# EAGLE design StartStopSwitch (EAGLE 9.6.2)
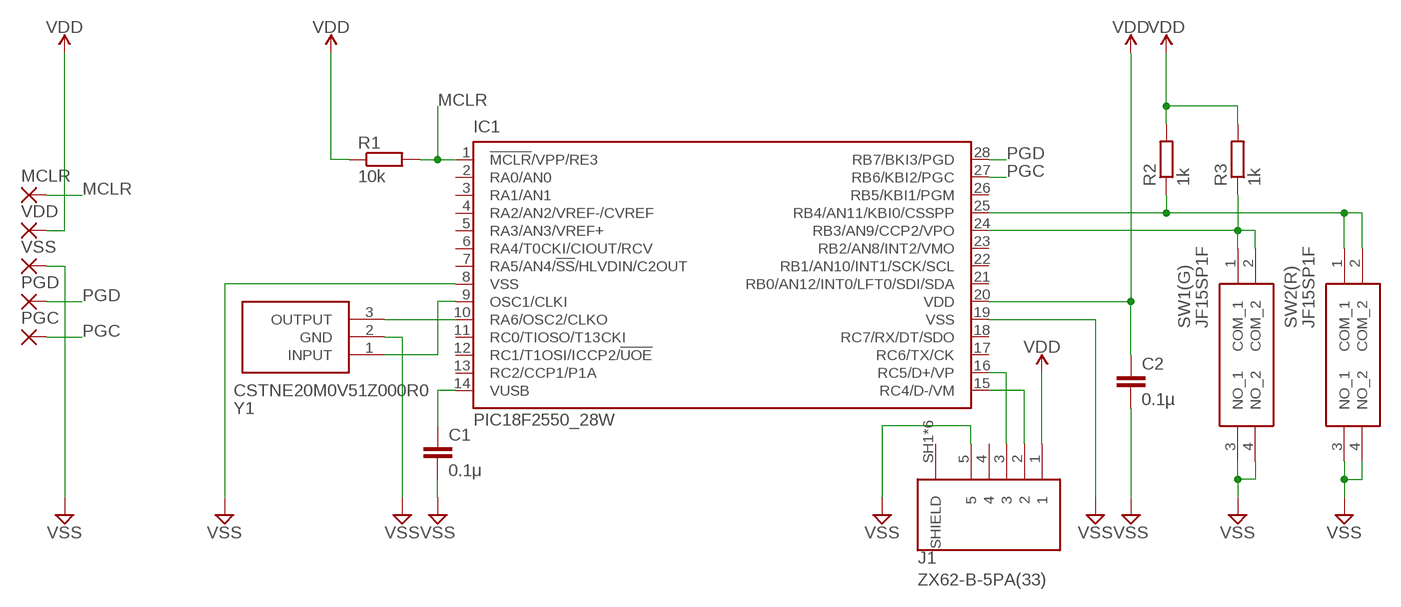
[diagram p0: schematic, sheet 1]

## Parts
C1  0.1μ  C-EUC0603  [C0603]
C2  0.1µ  C-EUC0603  [C0603]
IC1  PIC18F2550_28W  [SO28W]
J1  ZX62-B-5PA(33)  [HRS_ZX62-B-5PA(33)]
MCLR  1,6/0,8  [1,6/0,8]
PGC  1,6/0,8  [1,6/0,8]
PGD  1,6/0,8  [1,6/0,8]
R1  10k  R-EU_R0603  [R0603]
R2  1k  R-EU_R0603  [R0603]
R3  1k  R-EU_R0603  [R0603]
SW1(G)  JF15SP1F  [JF15SP1F]
SW2(R)  JF15SP1F  [JF15SP1F]
VDD  1,6/0,8  [1,6/0,8]
VSS  1,6/0,8  [1,6/0,8]
Y1  CSTNE20M0V51Z000R0  [CSTNE20M0V51Z000R0]

## Nets
MCLR: IC1.1(!MCLR!/VPP/RE3) MCLR.1(P) R1.2
N$1: C1.1 IC1.14(VUSB)
N$2: IC1.10(RA6/OSC2/CLKO) Y1.3(OUTPUT)
N$3: IC1.9(OSC1/CLKI) Y1.1(INPUT)
N$4: IC1.24(RB3/AN9/CCP2/VPO) R3.1 SW1(G).1(COM_1) SW1(G).2(COM_2)
N$5: IC1.25(RB4/AN11/KBI0/CSSPP) R2.1 SW2(R).1(COM_1) SW2(R).2(COM_2)
N$6: IC1.15(RC4/D-/VM) J1.2
N$7: IC1.16(RC5/D+/VP) J1.3
PGC: IC1.27(RB6/KBI2/PGC) PGC.1(P)
PGD: IC1.28(RB7/BKI3/PGD) PGD.1(P)
VDD [New Class]: C2.1 IC1.20(VDD) J1.1 R1.1 R2.2 R3.2 VDD.1(P)
VSS [New Class]: C1.2 C2.2 IC1.8(VSS) IC1.19(VSS) J1.5 SW1(G).3(NO_1) SW1(G).4(NO_2) SW2(R).3(NO_1) SW2(R).4(NO_2) VSS.1(P) Y1.2(GND)
Unconnected: IC1.2(RA0/AN0) IC1.3(RA1/AN1) IC1.4(RA2/AN2/VREF-/CVREF) IC1.5(RA3/AN3/VREF+) IC1.6(RA4/T0CKI/CIOUT/RCV) IC1.7(RA5/AN4/!SS!/HLVDIN/C2OUT) IC1.11(RC0/TIOSO/T13CKI) IC1.12(RC1/T1OSI/ICCP2/!UOE) IC1.13(RC2/CCP1/P1A) IC1.17(RC6/TX/CK) IC1.18(RC7/RX/DT/SDO) IC1.21(RB0/AN12/INT0/LFT0/SDI/SDA) IC1.22(RB1/AN10/INT1/SCK/SCL) IC1.23(RB2/AN8/INT2/VMO) IC1.26(RB5/KBI1/PGM) J1.4 J1.SH1(SHIELD) J1.SH2(SHIELD) J1.SH3(SHIELD) J1.SH4(SHIELD) J1.SH5(SHIELD) J1.SH6(SHIELD)

## Library data of the parts
C1 C2 = rcl:C-EU: CAPACITOR, European symbol; SPICEPREFIX: C
IC1 = microchip:PIC18F2*_28: USB Microcontrollers with nanoWatt Technology High-Performance, Enhanced Flash, 28/40/44-Pin, Source: http://ww1.microchip.com/downloads/en/devicedoc/39632c.pdf; MF: MICROCHIP; MPN: PIC18F2550-I/SO; OC_FARNELL: 9321268; OC_NEWARK: 73K1297
J1 = ZX62-B-5PA_33_:ZX62-B-5PA(33): ZX Series 5 Position Right Angle PCB Wire Micro B USB Plug Check prices <https://pricing.snapeda.com/parts/ZX62-B-5PA%2833%29/Hirose/view-part?ref=eda>; AVAILABILITY: In Stock; DESCRIPTION: USB - micro B USB 2.0 Receptacle Connector 5 Position Surface Mount, Right Angle; MF: Hirose; MP: ZX62-B-5PA(33); PACKAGE: None; PRICE: None; PURCHASE-URL: https://pricing.snapeda.com/search/part/ZX62-B-5PA(33)/?ref=eda
MCLR PGC PGD VDD VSS = wirepad:1,6/0,8: THROUGH-HOLE PAD
R1-R3 = rcl:R-EU_: RESISTOR, European symbol; SPICEPREFIX: R
SW1(G) SW2(R) = JF15SP1F:JF15SP1F: Green Short Tactile Switch, SPST 50 mA PCB Source: Datasheet <https://www.nkkswitches.com/pdf/JFnonilluminated-1.pdf>; DESCRIPTION: Green Short Tactile Switch, SPST 50 mA PCB; HEIGHT: 5.08mm; MANUFACTURER_NAME: NKK Switches; MANUFACTURER_PART_NUMBER: JF15SP1F; MOUSER_PART_NUMBER: 633-JF15SP1F; MOUSER_PRICE-STOCK: https://www.mouser.co.uk/ProductDetail/NKK-Switches/JF15SP1F?qs=wTfwsrvDt9Gm8MZ8yO4VCw%3D%3D
Y1 = CSTNE20M0V51Z000R0:CSTNE20M0V51Z000R0: Ceramic Resonator 20MHz +/-0.5% (Tol) +/-0.3% (Stability) 5pF 40Ohm 3-Pin SMD T/R Source: Datasheet <https://www.mouser.co.uk/datasheet/2/281/murata_04192018_CSTN_CeramResonCERAL-1323383.pdf>; DESCRIPTION: Ceramic Resonator 20MHz +/-0.5% (Tol) +/-0.3% (Stability) 5pF 40Ohm 3-Pin SMD T/R; HEIGHT: 1mm; MANUFACTURER_NAME: Murata Electronics; MANUFACTURER_PART_NUMBER: CSTNE20M0V51Z000R0; MOUSER_PART_NUMBER: 81-CSTNE20M0V51Z000R; MOUSER_PRICE-STOCK: https://www.mouser.co.uk/ProductDetail/Murata-Electronics/CSTNE20M0V51Z000R0?qs=xZ%2FP%252Ba9zWqbIGL%252Bno%252BEDrw%3D%3D

## Net classes
0 default: width 0.203 mm
1 New Class: width 0.254 mm

## Board
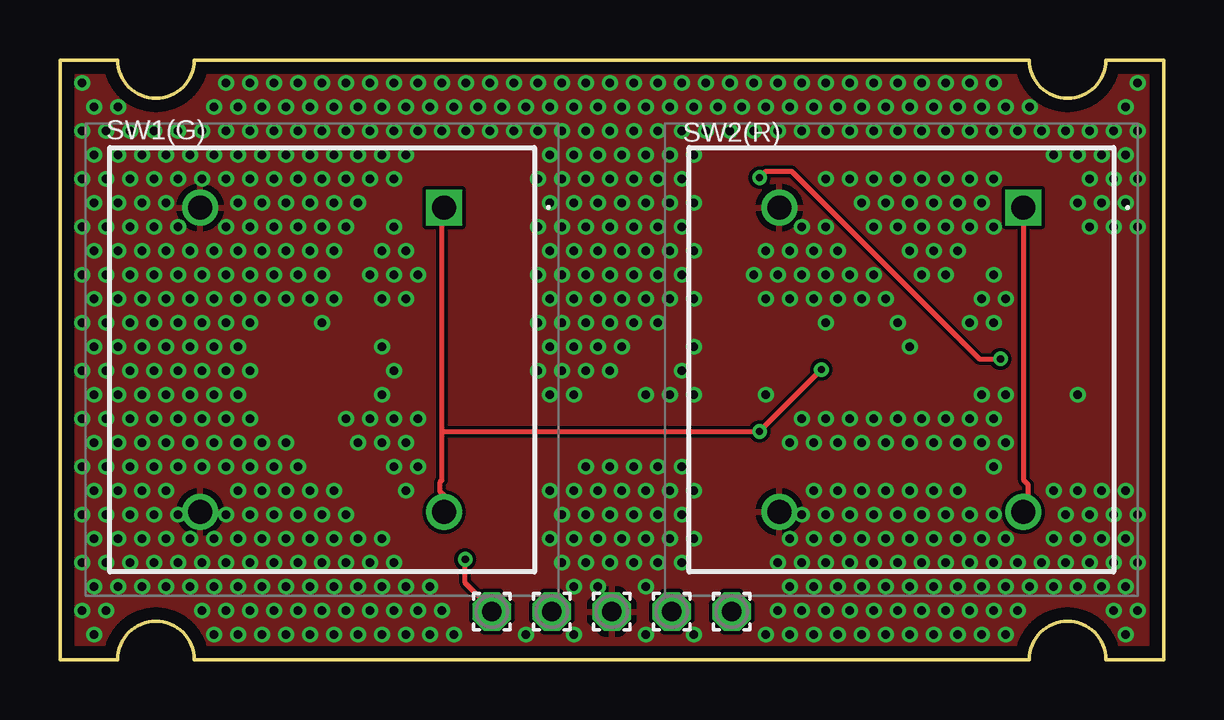
[diagram p1: board, top side]
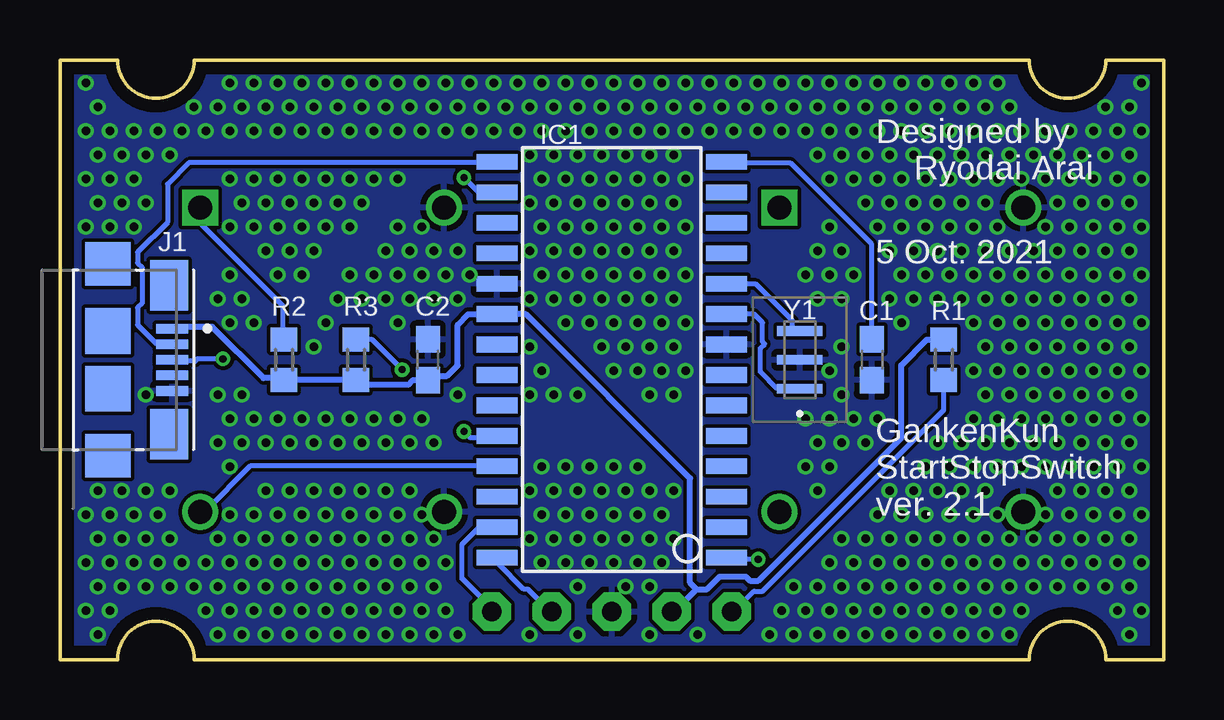
[diagram p2: board, bottom side, seen from below]

Size 46 x 25 mm. Coordinates in mm from the lower left corner, seen from the top.
Outline: 0,0 2.4,0 arc-180 5.6,0 40.4,0 arc-180 43.6,0 46,0 46,25 43.6,25 arc-180 40.4,25 5.6,25 arc-180 2.4,25 0,25 0,0
Copper layers (1*16): Top 0.035mm / dielectric 1.6mm / Bottom 0.035mm
Design rules "Elecrow_2-layer_PCB_eagle_rule": minimum track width 6mil, minimum drill 12mil, track to track 6mil, track to pad 6mil, pad to pad 6mil, via to via 8mil, smd to smd 0mil, copper to edge 20mil, drill to drill 10mil, minimum pad ring 6mil, minimum via ring 6mil, stop-mask expansion 0mil, vias tented up to drill 100mil, thermal gap 10mil

### Footprints (pad centres in the part's own frame; a part is rotated, then mirrored left to right if it is on the bottom)
C0603 = smd 1.1 x 1: 1 -0.85,0; 2 0.85,0
SO28W = smd 0.65 x 1.7: 1 -7.62,-4.78; 2 -6.35,-4.78; 3 -5.08,-4.78; 4 -3.81,-4.78; 5 -2.54,-4.78; 6 -1.27,-4.78; 7 0,-4.78; 8 1.27,-4.78; 9 2.54,-4.78; 10 3.81,-4.78; 11 5.08,-4.78; 12 6.35,-4.78; 13 7.62,-4.78; 14 8.89,-4.78; 15 8.89,4.78; 16 7.62,4.78; 17 6.35,4.78; 18 5.08,4.78; 19 3.81,4.78; 20 2.54,4.78; 21 1.27,4.78; 22 0,4.78; 23 -1.27,4.78; 24 -2.54,4.78; 25 -3.81,4.78; 26 -5.08,4.78; 27 -6.35,4.78; 28 -7.62,4.78
HRS_ZX62-B-5PA(33) = smd 0.4 x 1.35: 1 -1.3,2.675; 2 -0.65,2.675; 3 0,2.675; 4 0.65,2.675; 5 1.3,2.675 | smd 2.1 x 1.6: SH1 -3.1,2.55; SH6 3.1,2.55 | smd 1.8 x 1.9: SH2 -4,0; SH5 4,0 | smd 1.9 x 1.9: SH3 -1.2,0; SH4 1.2,0
1,6/0,8 = drill 0.813 pad 1.6 octagon: 1 0,0
R0603 = smd 1 x 1.1: 1 -0.85,0; 2 0.85,0
JF15SP1F = drill 1 pad 1.5 square: 1 0,0 | drill 1 pad 1.5: 2 0,-12.7; 3 -10.16,0; 4 -10.16,-12.7
CSTNE20M0V51Z000R0 = smd 0.4 x 1.9: 1 -1.2,0; 2 0,0; 3 1.2,0

### Placement (x,y rotation side)
C1  12.16,12.5 270 bottom
C2  30.66,12.5 90 bottom
IC1  23,11.87 90 bottom
J1  44,12.5 270 bottom
MCLR  18,2 0 top
PGC  28,2 0 top
PGD  25.5,2 0 top
R1  9.16,12.5 270 bottom
R2  36.66,12.5 270 bottom
R3  33.66,12.5 270 bottom
SW1(G)  16.01,18.85 0 top
SW2(R)  40.15,18.85 0 top
VDD  20.5,2 0 top
VSS  23,2 0 top
Y1  15.16,12.5 90 bottom

### Tracks (layer width: path | path; a pad name or v marks a point on that pad's centre or on a via)
MCLR  (via drill 0.3)
  Top 0.203: v16.89,4.18 16.89,3.2 18.05,2.04 MCLR.1
  Bottom 0.203: R1.2 9.16,10.4 16.71,2.85 17.07,2.85 17.96,1.96 MCLR.1 | v16.89,4.18 18.14,4.18 IC1.1
N$1
  Bottom 0.203: C1.1 12.18,13.42 12.18,17.34 15.56,20.71 18.14,20.71 IC1.14
N$2
  Bottom 0.203: IC1.10 18.14,15.65 16.98,15.65 15.47,14.13 15.47,13.87 15.38,13.78 15.2,13.78 Y1.3
N$3
  Bottom 0.203: IC1.9 18.14,14.4 17.07,14.4 16.71,14.05 16.71,13.25 16.62,13.16 16.8,12.98 16.8,12 16.09,11.29 15.2,11.29 Y1.1
N$4  (via drill 0.3)
  Top 0.203: v31.74,12.09 v29.16,9.51 15.91,9.51 | 15.91,9.51 15.91,18.76 SW1(G).1 | 15.91,9.51 15.91,7.47 15.82,7.38 15.82,7.02 16,6.84 16,6.22 SW1(G).2
  Bottom 0.203: v31.74,12.09 32.98,13.34 33.6,13.34 R3.1 | v29.16,9.51 28.89,9.25 27.83,9.25 IC1.24
N$5
  Top 0.203: SW2(R).1 40.18,18.85 40.18,7.47 40.36,7.29 40.36,6.4 40.18,6.22 SW2(R).2
  Bottom 0.203: R2.1 36.72,13.42 36.72,14.76 40.09,18.14 40.09,18.85 SW2(R).1 | IC1.25 27.83,8.09 38.05,8.09 39.92,6.22 40.09,6.22 SW2(R).2
N$6
  Bottom 0.203: J1.2 41.96,13.16 42.76,13.96 42.76,14.67 42.58,14.85 42.58,16.36 42.76,16.54 42.76,16.98 41.52,18.22 41.52,19.82 40.63,20.71 27.83,20.71 IC1.15
N$7  (via drill 0.3)
  Top 0.203: v39.2,12.54 38.32,12.54 30.49,20.36 29.43,20.36 v29.16,20.09
  Bottom 0.203: v39.2,12.54 40.27,12.54 40.36,12.45 41.25,12.45 J1.3 | v29.16,20.09 28.54,19.47 27.83,19.47 IC1.16
PGC
  Bottom 0.203: IC1.27 27.83,5.51 28.54,5.51 29.25,4.8 29.25,3.38 27.91,2.04 PGC.1
PGD
  Bottom 0.203: IC1.28 27.74,4.18 27.74,4 26.67,2.93 26.49,2.93 25.51,1.96 PGD.1
VDD
  Bottom 0.254: J1.1 41.25,13.87 39.65,13.87 37.52,11.73 36.72,11.73 R2.2 36.63,11.65 33.78,11.65 R3.2 33.6,11.65 33.43,11.47 31.47,11.47 31.29,11.65 C2.1 30.58,11.73 30.49,11.82 29.87,11.82 29.43,12.27 29.43,13.96 28.98,14.4 27.83,14.4 IC1.20 27.74,14.4 26.58,14.4 19.74,7.56 19.74,3.2 19.47,2.93 | 19.47,2.93 19.02,2.93 18.49,3.47 17.42,3.47 17.25,3.29 16.89,3.29 10.94,9.25 10.94,12.27 9.87,13.34 9.25,13.34 R1.1 | 19.47,2.93 20.45,1.96 VDD.1
VSS  (via drill 0.35)
  other vias: 1.42,1.04 0.92,2.04 1.42,3.04 0.92,4.04 1.42,5.04 0.92,6.04 1.42,7.04 0.92,8.04 1.42,9.04 0.92,10.04 1.42,11.04 0.92,12.04 1.42,13.04 0.92,14.04 1.42,15.04 0.92,16.04 1.42,17.04 0.92,18.04 1.42,19.04 0.92,20.04 1.42,21.04 0.92,22.04 1.42,23.04 0.92,24.04 1.92,2.04 2.42,3.04 1.92,4.04 2.42,5.04 1.92,6.04 2.42,7.04 1.92,8.04 2.42,9.04 1.92,10.04 2.42,11.04 1.92,12.04 2.42,13.04 1.92,14.04 2.42,15.04 1.92,16.04 2.42,17.04 1.92,18.04 2.42,19.04 1.92,20.04 2.42,21.04 1.92,22.04 2.42,23.04 3.42,3.04 2.92,4.04 3.42,5.04 2.92,6.04 3.42,7.04 2.92,8.04 3.42,9.04 2.92,10.04 3.42,11.04 2.92,12.04 3.42,13.04 2.92,14.04 3.42,15.04 2.92,16.04 3.42,17.04 2.92,18.04 3.42,19.04 2.92,20.04 3.42,21.04 2.92,22.04 4.42,3.04 3.92,4.04 4.42,5.04 3.92,6.04 4.42,7.04 3.92,8.04 4.42,9.04 3.92,10.04 4.42,11.04 3.92,12.04 4.42,13.04 3.92,14.04 4.42,15.04 3.92,16.04 4.42,17.04 3.92,18.04 4.42,19.04 3.92,20.04 4.42,21.04 3.92,22.04 5.42,3.04 4.92,4.04 5.42,5.04 4.92,6.04 4.92,8.04 5.42,9.04 4.92,10.04 5.42,11.04 4.92,12.04 5.42,13.04 4.92,14.04 5.42,15.04 4.92,16.04 5.42,17.04 4.92,18.04 4.92,20.04 5.42,21.04 4.92,22.04 6.42,1.04 5.92,2.04 6.42,3.04 5.92,4.04 6.42,5.04 5.92,8.04 6.42,9.04 5.92,10.04 6.42,11.04 5.92,12.04 6.42,13.04 5.92,14.04 6.42,15.04 5.92,16.04 6.42,17.04 5.92,20.04 6.42,21.04 5.92,22.04 6.42,23.04 7.42,1.04 6.92,2.04 7.42,3.04 6.92,4.04 7.42,5.04 6.92,6.04 7.42,7.04 6.92,8.04 7.42,9.04 6.92,10.04 7.42,11.04 6.92,12.04 7.42,13.04 6.92,14.04 7.42,15.04 6.92,16.04 7.42,17.04 6.92,18.04 7.42,19.04 6.92,20.04 7.42,21.04 6.92,22.04 7.42,23.04 6.92,24.04 8.42,1.04 7.92,2.04 8.42,3.04 7.92,4.04 8.42,5.04 7.92,6.04 8.42,7.04 7.92,8.04 8.42,9.04 7.92,10.04 7.92,12.04 7.92,14.04 8.42,15.04 7.92,16.04 8.42,17.04 7.92,18.04 8.42,19.04 7.92,20.04 8.42,21.04 7.92,22.04 8.42,23.04 7.92,24.04 9.42,1.04 8.92,2.04 9.42,3.04 8.92,4.04 9.42,5.04 8.92,6.04 9.42,7.04 8.92,8.04 9.42,9.04 9.42,15.04 8.92,16.04 9.42,17.04 8.92,18.04 9.42,19.04 8.92,20.04 9.42,21.04 8.92,22.04 9.42,23.04 8.92,24.04 10.42,1.04 9.92,2.04 10.42,3.04 9.92,4.04 10.42,5.04 9.92,6.04 10.42,7.04 9.92,8.04 10.42,15.04 9.92,16.04 10.42,17.04 9.92,18.04 10.42,19.04 9.92,20.04 10.42,21.04 9.92,22.04 10.42,23.04 9.92,24.04 11.42,1.04 10.92,2.04 11.42,3.04 10.92,4.04 11.42,5.04 10.92,6.04 11.42,7.04 10.92,14.04 11.42,15.04 10.92,16.04 11.42,17.04 10.92,18.04 11.42,19.04 10.92,20.04 11.42,21.04 10.92,22.04 11.42,23.04 10.92,24.04 12.42,1.04 11.92,2.04 12.42,3.04 11.92,4.04 12.42,5.04 11.92,6.04 12.42,9.04 11.92,10.04 11.92,18.04 12.42,19.04 11.92,20.04 12.42,21.04 11.92,22.04 12.42,23.04 11.92,24.04 13.42,1.04 12.92,2.04 13.42,3.04 12.92,4.04 13.42,5.04 13.42,9.04 12.92,10.04 13.42,11.04 13.42,13.04 13.42,15.04 12.92,16.04 13.42,17.04 12.92,20.04 13.42,21.04 12.92,22.04 13.42,23.04 12.92,24.04 14.42,1.04 13.92,2.04 14.42,3.04 13.92,4.04 14.42,7.04 13.92,8.04 14.42,9.04 13.92,10.04 13.92,12.04 14.42,15.04 13.92,16.04 14.42,17.04 13.92,18.04 13.92,20.04 14.42,21.04 13.92,22.04 14.42,23.04 13.92,24.04 15.42,1.04 14.92,2.04 15.42,3.04 14.92,8.04 14.92,10.04 14.92,16.04 14.92,22.04 15.42,23.04 14.92,24.04 16.42,1.04 15.92,2.04 15.92,22.04 16.42,23.04 15.92,24.04 16.92,22.04 17.42,23.04 16.92,24.04 17.92,22.04 18.42,23.04 17.92,24.04 19.42,1.04 18.92,22.04 19.42,23.04 18.92,24.04 20.42,5.04 20.42,7.04 20.42,11.04 19.92,12.04 20.42,13.04 19.92,14.04 20.42,15.04 19.92,16.04 20.42,17.04 19.92,18.04 20.42,19.04 19.92,20.04 20.42,21.04 19.92,22.04 20.42,23.04 19.92,24.04 21.42,1.04 21.42,3.04 20.92,4.04 21.42,5.04 20.92,6.04 21.42,7.04 21.42,11.04 20.92,12.04 21.42,13.04 20.92,14.04 21.42,15.04 20.92,16.04 21.42,17.04 20.92,18.04 21.42,19.04 20.92,20.04 21.42,21.04 20.92,22.04 21.42,23.04 20.92,24.04 22.42,3.04 21.92,4.04 22.42,5.04 21.92,6.04 22.42,7.04 21.92,8.04 21.92,12.04 22.42,13.04 21.92,14.04 22.42,15.04 21.92,16.04 22.42,17.04 21.92,18.04 22.42,19.04 21.92,20.04 22.42,21.04 21.92,22.04 22.42,23.04 21.92,24.04 22.92,4.04 23.42,5.04 22.92,6.04 23.42,7.04 22.92,8.04 22.92,12.04 23.42,13.04 22.92,14.04 23.42,15.04 22.92,16.04 23.42,17.04 22.92,18.04 23.42,19.04 22.92,20.04 23.42,21.04 22.92,22.04 23.42,23.04 22.92,24.04 24.42,1.04 24.42,3.04 23.92,4.04 24.42,5.04 23.92,6.04 24.42,7.04 23.92,8.04 24.42,11.04 23.92,14.04 24.42,15.04 23.92,16.04 24.42,17.04 23.92,18.04 24.42,19.04 23.92,20.04 24.42,21.04 23.92,22.04 24.42,23.04 23.92,24.04 24.92,4.04 25.42,5.04 24.92,6.04 25.42,7.04 24.92,8.04 25.42,11.04 24.92,14.04 25.42,15.04 24.92,16.04 25.42,17.04 24.92,18.04 25.42,19.04 24.92,20.04 25.42,21.04 24.92,22.04 25.42,23.04 24.92,24.04 26.42,1.04 25.92,4.04 26.42,5.04 25.92,6.04 26.42,7.04 25.92,8.04 26.42,11.04 25.92,12.04 26.42,13.04 26.42,15.04 25.92,16.04 26.42,17.04 25.92,18.04 26.42,19.04 25.92,20.04 26.42,21.04 25.92,22.04 26.42,23.04 25.92,24.04 26.92,22.04 27.42,23.04 26.92,24.04 27.92,22.04 28.42,23.04 27.92,24.04 29.42,1.04 29.42,11.04 29.42,15.04 28.92,16.04 29.42,17.04 28.92,22.04 29.42,23.04 28.92,24.04 30.42,1.04 29.92,2.04 30.42,3.04 29.92,4.04 30.42,5.04 30.42,9.04 30.42,15.04 29.92,16.04 30.42,17.04 29.92,22.04 30.42,23.04 29.92,24.04 31.42,1.04 30.92,2.04 31.42,3.04 30.92,4.04 31.42,5.04 30.92,6.04 31.42,7.04 31.42,9.04 30.92,10.04 31.42,15.04 30.92,16.04 31.42,17.04 30.92,18.04 30.92,22.04 31.42,23.04 30.92,24.04 32.42,1.04 31.92,2.04 32.42,3.04 31.92,4.04 32.42,5.04 31.92,6.04 32.42,7.04 32.42,9.04 31.92,10.04 31.92,14.04 32.42,15.04 31.92,16.04 32.42,17.04 31.92,18.04 31.92,20.04 31.92,22.04 32.42,23.04 31.92,24.04 33.42,1.04 32.92,2.04 33.42,3.04 32.92,4.04 33.42,5.04 32.92,6.04 33.42,7.04 33.42,9.04 32.92,10.04 33.42,15.04 32.92,16.04 33.42,19.04 32.92,20.04 32.92,22.04 33.42,23.04 32.92,24.04 34.42,1.04 33.92,2.04 34.42,3.04 33.92,4.04 34.42,5.04 33.92,6.04 34.42,7.04 34.42,9.04 33.92,10.04 34.42,15.04 33.92,16.04 33.92,18.04 34.42,19.04 33.92,20.04 33.92,22.04 34.42,23.04 33.92,24.04 35.42,1.04 34.92,2.04 35.42,3.04 34.92,4.04 35.42,5.04 34.92,6.04 35.42,7.04 35.42,9.04 34.92,10.04 35.42,13.04 34.92,14.04 35.42,17.04 34.92,18.04 35.42,19.04 34.92,20.04 34.92,22.04 35.42,23.04 34.92,24.04 36.42,1.04 35.92,2.04 36.42,3.04 35.92,4.04 36.42,5.04 35.92,6.04 36.42,7.04 36.42,9.04 35.92,10.04 35.92,16.04 36.42,17.04 35.92,18.04 36.42,19.04 35.92,20.04 35.92,22.04 36.42,23.04 35.92,24.04 37.42,1.04 36.92,2.04 37.42,3.04 36.92,4.04 37.42,5.04 36.92,6.04 37.42,7.04 37.42,9.04 36.92,10.04 36.92,16.04 37.42,17.04 36.92,18.04 37.42,19.04 36.92,20.04 36.92,22.04 37.42,23.04 36.92,24.04 38.42,1.04 37.92,2.04 38.42,3.04 37.92,4.04 38.42,5.04 37.92,6.04 38.42,9.04 37.92,10.04 38.42,11.04 37.92,14.04 38.42,15.04 37.92,18.04 38.42,19.04 37.92,20.04 37.92,22.04 38.42,23.04 37.92,24.04 39.42,1.04 38.92,2.04 39.42,3.04 38.92,4.04 39.42,5.04 38.92,6.04 38.92,8.04 39.42,9.04 38.92,10.04 39.42,11.04 38.92,14.04 39.42,15.04 38.92,16.04 38.92,18.04 38.92,20.04 38.92,22.04 39.42,23.04 38.92,24.04 39.92,2.04 40.42,3.04 39.92,4.04 39.92,22.04 40.42,23.04 41.42,3.04 40.92,4.04 41.42,5.04 41.42,7.04 41.42,21.04 40.92,22.04 42.42,3.04 41.92,4.04 42.42,5.04 41.92,6.04 42.42,7.04 42.42,11.04 42.42,19.04 42.42,21.04 41.92,22.04 43.42,3.04 42.92,4.04 43.42,5.04 42.92,6.04 43.42,7.04 42.92,18.04 43.42,19.04 42.92,20.04 43.42,21.04 42.92,22.04 44.42,1.04 43.92,2.04 44.42,3.04 43.92,4.04 44.42,5.04 43.92,6.04 44.42,7.04 43.92,18.04 44.42,19.04 43.92,20.04 44.42,21.04 43.92,22.04 44.42,23.04 44.92,2.04 44.92,4.04 44.92,6.04 44.92,18.04 44.92,20.04 44.92,22.04 44.92,24.04
  pour Top: 0,25 0,0 46,0 46,25
  pour Bottom: 0,25 0,0 46,0 46,25

### Text on the board
tPlace: ‸
bPlace: Designed by / Ryodai Arai | 5 Oct. 2021 | GankenKun / StartStopSwitch / ver. 2.1